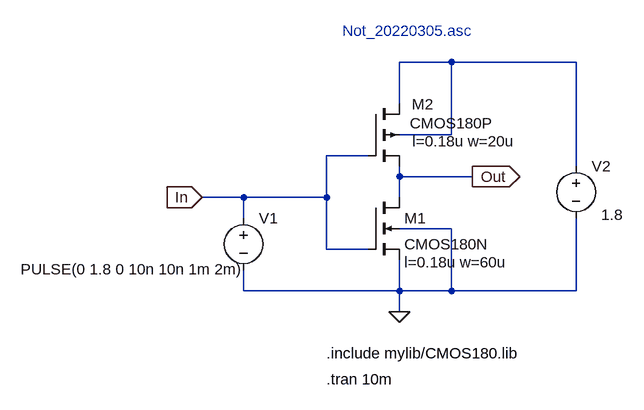
[diagram p0: schematic Not_20220305.asc]
Not_20220305.asc, the LTspice schematic file:
Version 4
SHEET 1 880 680
WIRE 240 -192 160 -192
WIRE 432 -192 240 -192
WIRE 160 -128 160 -192
WIRE 240 -80 240 -192
WIRE 240 -80 160 -80
WIRE 112 -48 48 -48
WIRE 432 -32 432 -192
WIRE 160 -16 160 -32
WIRE 272 -16 160 -16
WIRE -80 16 -144 16
WIRE 48 16 48 -48
WIRE 48 16 -80 16
WIRE 160 16 160 -16
WIRE -80 48 -80 16
WIRE 240 64 160 64
WIRE 48 96 48 16
WIRE 112 96 48 96
WIRE -80 160 -80 128
WIRE 160 160 160 112
WIRE 160 160 -80 160
WIRE 240 160 240 64
WIRE 240 160 160 160
WIRE 432 160 432 48
WIRE 432 160 240 160
WIRE 160 192 160 160
FLAG 160 192 0
FLAG 272 -16 Out
IOPIN 272 -16 Out
FLAG -144 16 In
IOPIN -144 16 In
SYMBOL nmos4 112 16 R0
WINDOW 123 56 100 Left 2
SYMATTR Value2 l=0.18u w=60u
SYMATTR InstName M1
SYMATTR Value CMOS180N
SYMBOL voltage 432 -48 R0
WINDOW 3 39 91 Left 2
WINDOW 123 0 0 Left 0
WINDOW 39 0 0 Left 0
SYMATTR Value 1.8
SYMATTR InstName V2
SYMBOL pmos4 112 -128 R0
WINDOW 0 67 1 Left 2
WINDOW 3 64 30 Left 2
WINDOW 123 68 58 Left 2
SYMATTR InstName M2
SYMATTR Value CMOS180P
SYMATTR Value2 l=0.18u w=20u
SYMBOL voltage -80 32 R0
WINDOW 3 -343 95 Left 2
WINDOW 123 0 0 Left 0
WINDOW 39 0 0 Left 0
SYMATTR Value PULSE(0 1.8 0 10n 10n 1m 2m)
SYMATTR InstName V1
TEXT 48 256 Left 2 !.include mylib/CMOS180.lib
TEXT 72 -240 Left 2 ;Not_20220305.asc
TEXT 48 296 Left 2 !.tran 10m

The netlist it stands for:
* Not_20220305.asc
M1 Out In 0 0 CMOS180N l=0.18u w=60u
V2 N001 0 1.8
M2 N001 In Out N001 CMOS180P l=0.18u w=20u
V1 In 0 PULSE(0 1.8 0 10n 10n 1m 2m)
.model NMOS NMOS
.model PMOS PMOS
.lib standard.mos
.include mylib/CMOS180.lib
* Not_20220305.asc
.tran 10m
.backanno
.end